# Altium schematic sheet Power.SchDoc
size A4
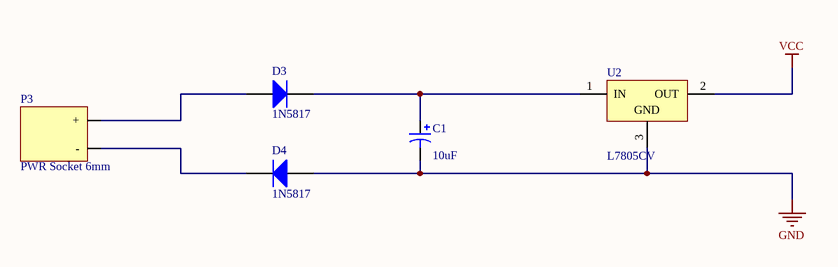
[diagram p0: Power.SchDoc]

## Parts
C1  value 10uF  [CAPPR1.5-4x5]  (hidden comment: Cap Pol1)
D3  1N5817  [1N5817]
D4  1N5817  [1N5817]
P3  PWR Socket 6mm  [PWR Socket 6mm]
U2  L7805CV  [TO220ABN]

## Nets
GND: C1.2 D4.A U2.3(GND)
VCC: U2.2(OUT)
NetC1_1: C1.1 D3.K U2.1(IN)
NetD3_A: D3.A P3.+
NetD4_K: D4.K P3.-

## Library data of the parts
C1 = Cap Pol1: Polarized Capacitor (Radial); Published: 8-Jun-2000; LatestRevisionDate: 17-Jul-2002; LatestRevisionNote: Re-released for DXP Platform.; PackageReference: RB7.6-15; Publisher: Altium Limited
U2 = L7805CV: Positive Voltage Regulator; Note: Tab is connected to pin 3 (GND).; Published: 24-Aug-2001; LatestRevisionDate: 17-Jul-2002; LatestRevisionNote: Re-released for DXP Platform.; DatasheetVersion: Dec-1998; PackageVersion: Jun-1998; PackageReference: TO220ABN; Publisher: Altium Limited; PackageDescription: TO, Thru-Hole, Vertical, Heatsink Mounted; 3 In-Line Leads; Pitch 2.54 mm; Pin sequence 1, 3, 2; ComponentLink1Description: Manufacturer Link; ComponentLink1URL: http://www.st.com/